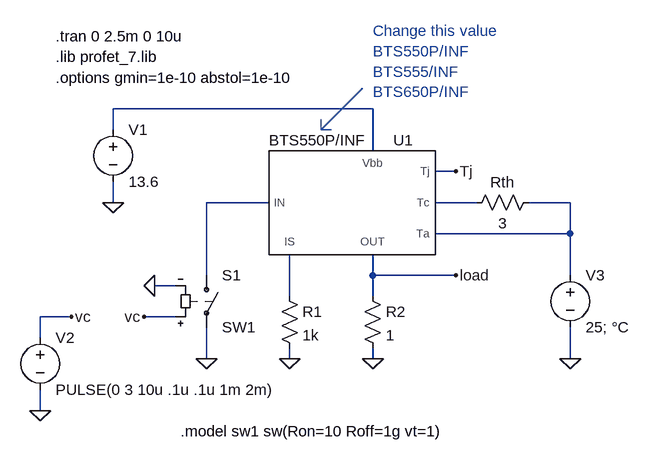
[diagram p0: schematic Profet_7_test.asc]
Profet_7_test.asc, the LTspice schematic file:
Version 4
SHEET 1 880 680
WIRE 320 -32 -80 -32
WIRE -80 0 -80 -32
WIRE 320 32 320 -32
WIRE 448 64 416 64
WIRE -80 112 -80 80
WIRE 160 112 64 112
WIRE 480 112 416 112
WIRE 624 112 560 112
WIRE 624 160 624 112
WIRE 624 160 416 160
WIRE 64 224 64 112
WIRE 320 224 320 192
WIRE 448 224 320 224
WIRE 624 224 624 160
WIRE 16 240 -16 240
WIRE 192 256 192 192
WIRE 320 256 320 224
WIRE -144 288 -192 288
WIRE 16 288 -32 288
WIRE -192 320 -192 288
WIRE 64 352 64 304
WIRE 192 352 192 336
WIRE 320 352 320 336
WIRE 624 352 624 304
WIRE -192 432 -192 400
FLAG 192 352 0
FLAG 320 352 0
FLAG 64 352 0
FLAG -16 240 0
FLAG -32 288 vc
FLAG -80 112 0
FLAG -192 432 0
FLAG -144 288 vc
FLAG 448 64 Tj
FLAG 624 352 0
FLAG 448 224 load
SYMBOL res 176 240 R0
SYMATTR InstName R1
SYMATTR Value 1k
SYMBOL res 304 240 R0
SYMATTR InstName R2
SYMATTR Value 1
SYMBOL sw 64 208 R0
SYMATTR InstName S1
SYMATTR Value SW1
SYMBOL voltage -80 -16 R0
SYMATTR InstName V1
SYMATTR Value 13.6
SYMBOL voltage -192 304 R0
WINDOW 123 0 0 Left 0
WINDOW 39 0 0 Left 0
SYMATTR InstName V2
SYMATTR Value PULSE(0 3 10u .1u .1u 1m 2m)
SYMBOL voltage 624 208 R0
SYMATTR InstName V3
SYMATTR Value 25; °C
SYMBOL res 464 128 R270
WINDOW 0 32 56 VTop 0
WINDOW 3 0 56 VBottom 0
SYMATTR InstName Rth
SYMATTR Value 3
SYMBOL PROFET_7 256 112 R0
SYMATTR InstName U1
TEXT 24 464 Left 0 !.model sw1 sw(Ron=10 Roff=1g vt=1)
TEXT -168 -144 Left 0 !.tran 0 2.5m 0 10u
TEXT -168 -112 Left 0 !.lib profet_7.lib
TEXT -168 -80 Left 0 !.options gmin=1e-10 abstol=1e-10
TEXT 320 -152 Left 0 ;Change this value \nBTS550P/INF\nBTS555/INF\nBTS650P/INF
LINE Normal 240 0 304 -64
LINE Normal 256 0 240 0
LINE Normal 240 -16 240 0

The netlist it stands for:
* Profet_7_test.asc
R1 N005 0 1k
R2 load 0 1
S1 N002 0 vc 0 SW1
V1 N001 0 13.6
V2 vc 0 PULSE(0 3 10u .1u .1u 1m 2m)
V3 N004 0 25; °C
Rth N003 N004 3
XU1 N002 N001 load N005 Tj N003 N004 BTS550P/INF  ; pins IN Vbb OUT IS Tj Tc Ta
.model sw1 sw(Ron=10 Roff=1g vt=1)
.tran 0 2.5m 0 10u
.lib profet_7.lib
.options gmin=1e-10 abstol=1e-10
* Change this value
* BTS550P/INF
* BTS555/INF
* BTS650P/INF
.backanno
.end